# EasyEDA Pro project Sivasankar's_Hackpad_.epro

# Schematic Schematic1_1
Board Name: Board1_1; Create Date: 2026-02-22; Page Name: P1; Project Name: Sivasankar's Hackpad00001; Schematic Name: Schematic1_1; Update Date: 2026-02-22; Company: EasyEDA.com; Page Size: A4; Version: V1.0
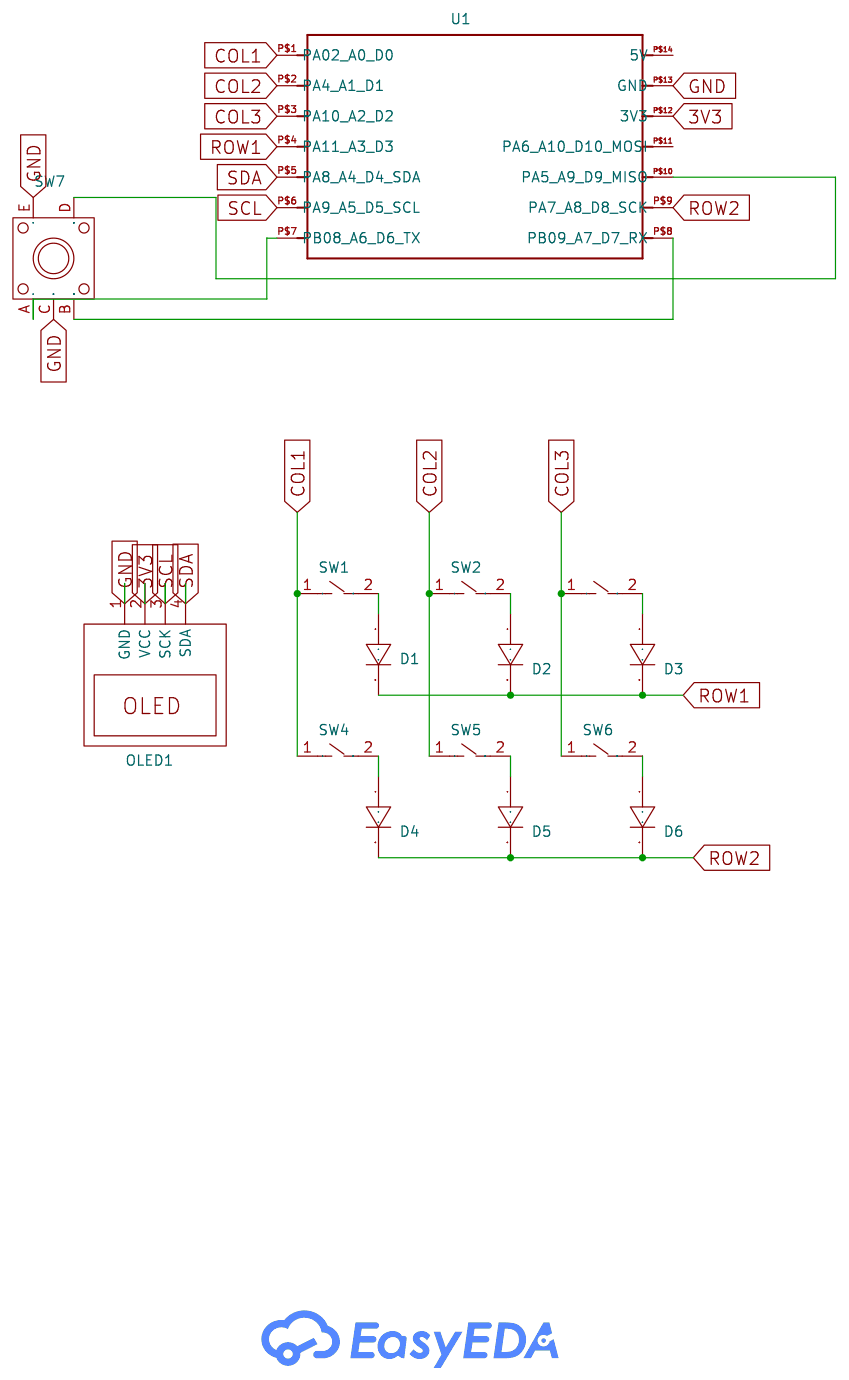
[diagram p0: schematic sheet]

## Parts
D1  1N4148  [DO-35_BD2.0-L4.0-P8.00-D0.5-FD]
D2  1N4148  [DO-35_BD2.0-L4.0-P8.00-D0.5-FD]
D3  1N4148  [DO-35_BD2.0-L4.0-P8.00-D0.5-FD]
D4  1N4148  [DO-35_BD2.0-L4.0-P8.00-D0.5-FD]
D5  1N4148  [DO-35_BD2.0-L4.0-P8.00-D0.5-FD]
D6  1N4148  [DO-35_BD2.0-L4.0-P8.00-D0.5-FD]
OLED1  OLED 0.91  [I2C OLED 0.91]
SW1  MX1A-E1NW  [SW-TH_MX1A-E1NW]
SW2  MX1A-E1NW  [SW-TH_MX1A-E1NW]
SW3  MX1A-E1NW  [SW-TH_MX1A-E1NW]
SW4  MX1A-E1NW  [SW-TH_MX1A-E1NW]
SW5  MX1A-E1NW  [SW-TH_MX1A-E1NW]
SW6  MX1A-E1NW  [SW-TH_MX1A-E1NW]
SW7  EC11  [SW-TH_EC111XXXX]
U1  XIAO_RP2040_XIAO_RP2040_THROUGH_HOLE  [XIAO_THROUGH_HOLE]

## Library data of the parts
D1-D6 = 1N4148_C258182: Diode Configuration: Forward Voltage (Vf@If):1V@10mA Reverse Voltage (Vr): Average Rectified Current (Io): Power Dissipation: Reverse Leakage Current:5uA@75V Reverse Recovery Time (trr): Operating Temperature:-55℃~+175℃@(Tj) Operating Temperature:-55℃~+17; Supplier: LCSC; Supplier Part: C258182; Manufacturer: onsemi(安森美); JLCPCB Part Class: Extended Part; LCSC Part Name: 电压:100V 电流:200mA; Supplier Footprint: DO-35; Datasheet: https://atta.szlcsc.com/upload/public/pdf/source/20180829/C258182_3EE2D0AB6109C1B72B054FC50B8BC8AD.pdf; Forward Voltage (Vf@If): 1V@10mA; Reverse Leakage Current: 5uA@75V; Operating Temperature: -55℃~+175℃@(Tj)
OLED1 = OLED 0.91: Manufacturer Part: SSD1306 I2C OLED
SW1-SW6 = MX1A-E1NW: Supplier Part: C5120587; Manufacturer: CHERRY; Supplier Footprint: 插件; JLCPCB Part Class: Extended Part; Datasheet: https://item.szlcsc.com/datasheet/MX1A-E1NW/5705589.html; Supplier: LCSC
SW7 = EC11: Supplier: LCSC; Supplier Part: C470788; Manufacturer: ALPS Electric; Manufacturer Part: EC1110120005
U1 = XIAO_RP2040_XIAO_RP2040_THROUGH_HOLE

## Nets
3V3: OLED1.2(VCC) U1.P$12(3V3)
GND: OLED1.1(GND) SW7.C SW7.E U1.P$13(GND)
COL1: SW1.1 SW4.1 U1.P$1(PA02_A0_D0)
COL2: SW2.1 SW5.1 U1.P$2(PA4_A1_D1)
COL3: SW3.1 SW6.1 U1.P$3(PA10_A2_D2)
ROW1: D1.2(K) D2.2(K) D3.2(K) U1.P$4(PA11_A3_D3)
ROW2: D4.2(K) D5.2(K) D6.2(K) U1.P$9(PA7_A8_D8_SCK)
SCL: OLED1.3(SCK) U1.P$6(PA9_A5_D5_SCL)
SDA: OLED1.4(SDA) U1.P$5(PA8_A4_D4_SDA)
$1N1168: D6.1(A) SW6.2
$1N4009: D1.1(A) SW1.2
$1N4013: D2.1(A) SW2.2
$1N4023: D3.1(A) SW3.2
$1N4070: D4.1(A) SW4.2
$1N4074: D5.1(A) SW5.2
$1N4276: SW7.A U1.P$7(PB08_A6_D6_TX)
$1N4283: SW7.B U1.P$8(PB09_A7_D7_RX)
$1N4379: SW7.D U1.P$10(PA5_A9_D9_MISO)

Not connected (* = marked no-connect by the designer): U1 P$11(PA6_A10_D10_MOSI) P$14(5V)

# Board PCB3_1
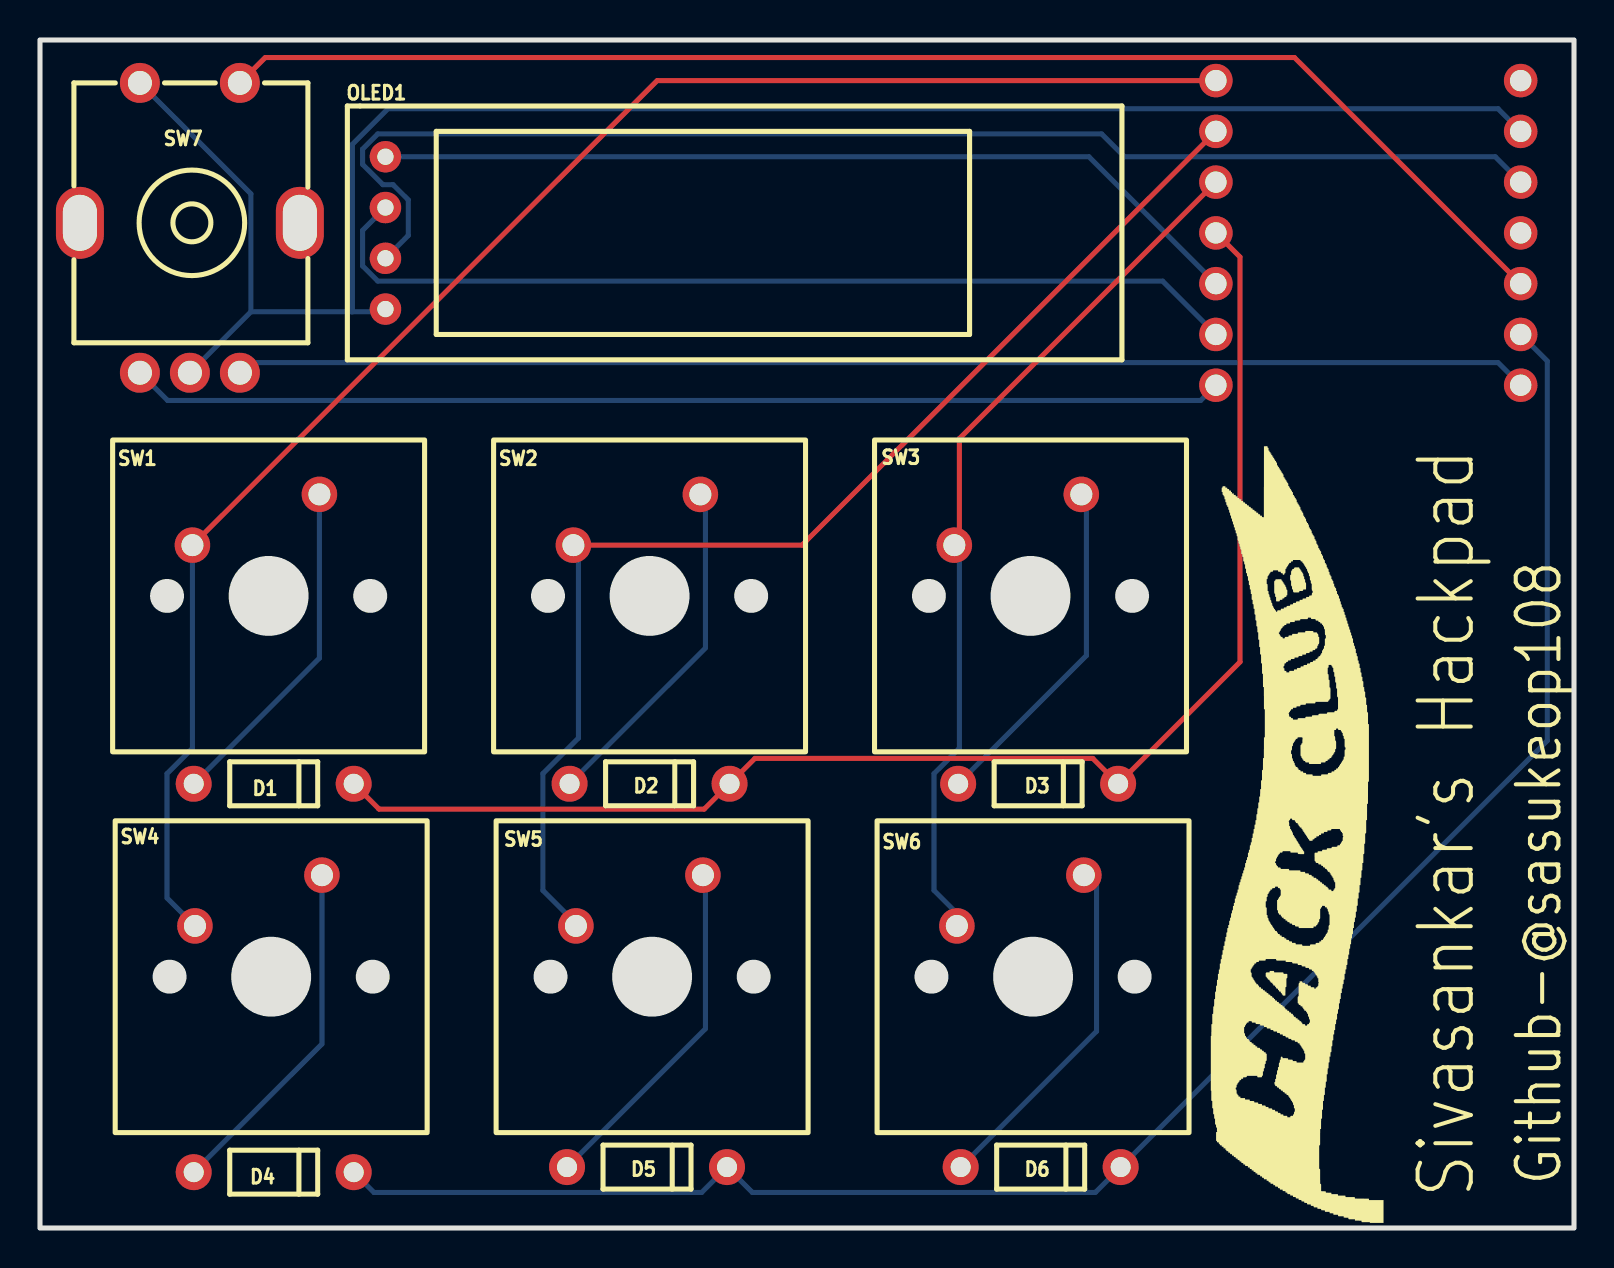
[diagram p1: board, top side]
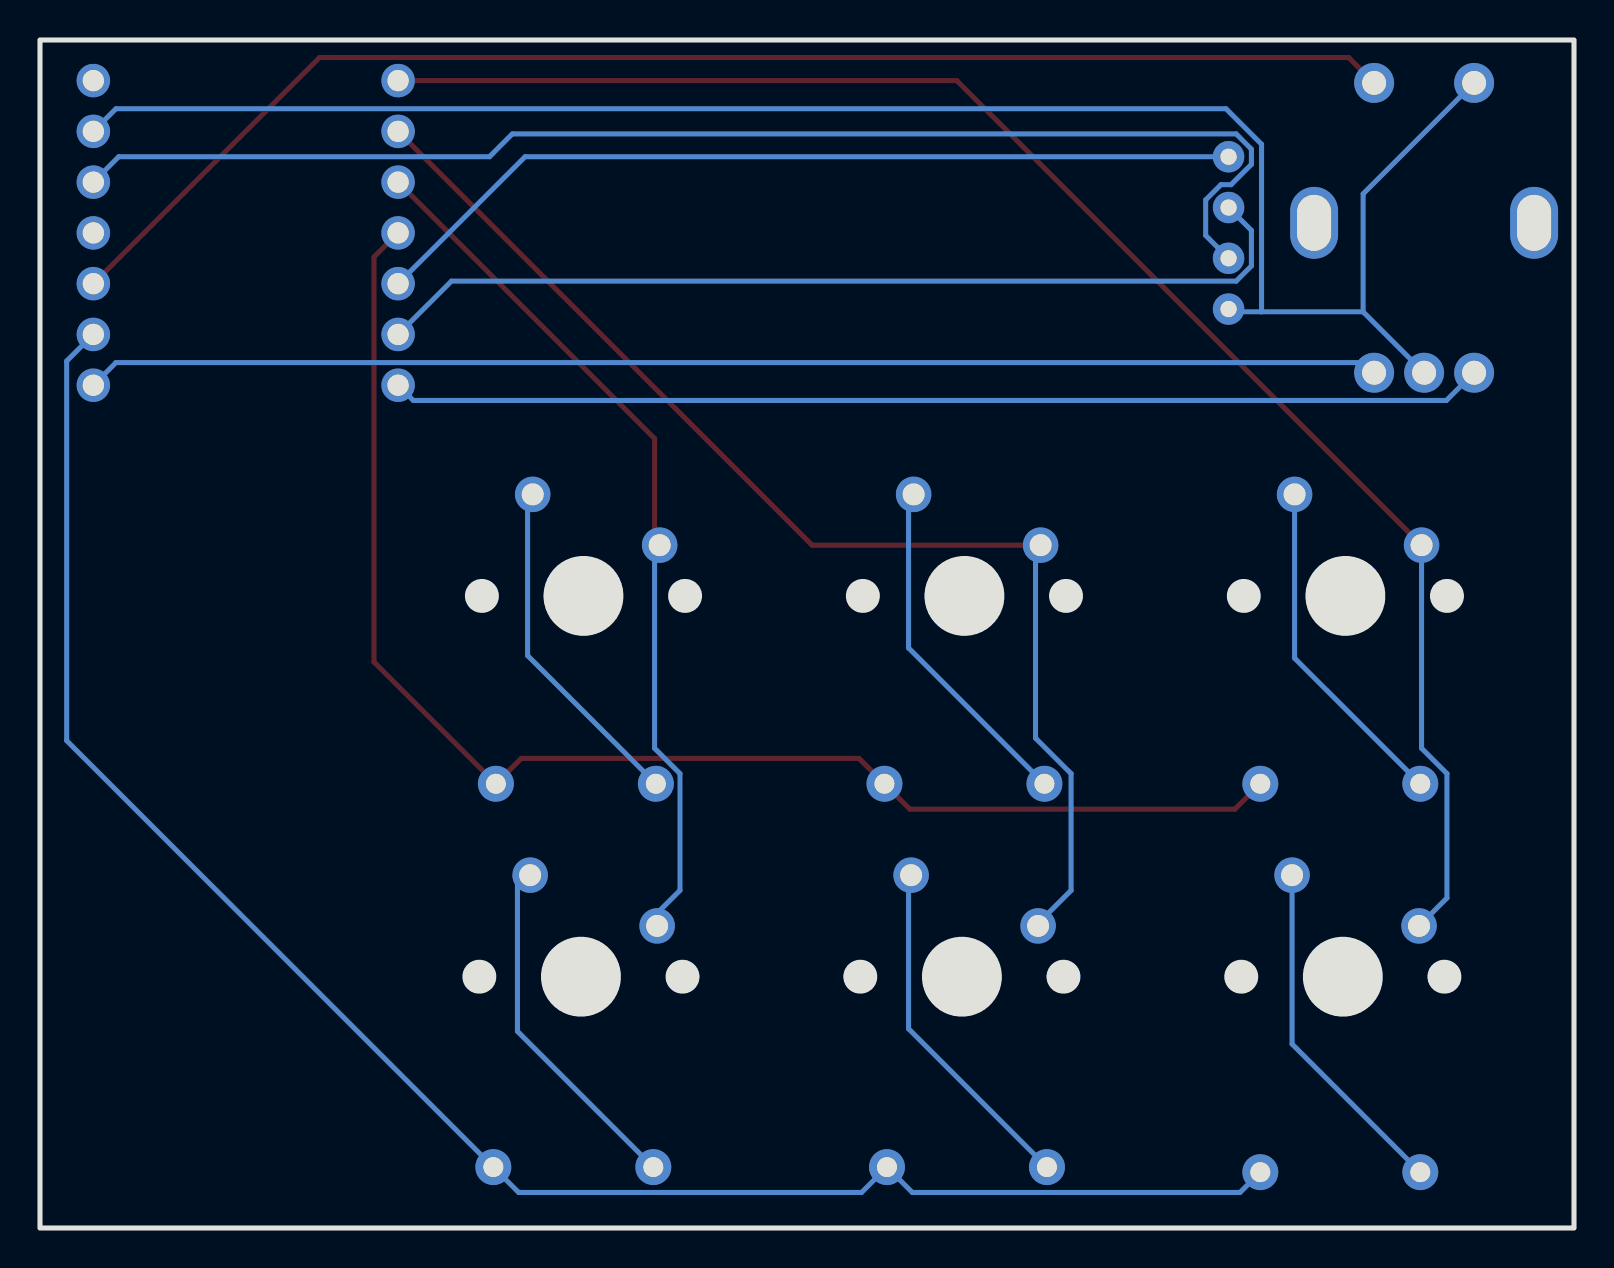
[diagram p2: board, bottom side, seen from below]

Outline 76.71 x 59.44 mm; copper layers: Top Layer, Bottom Layer. Coordinates in mm from the lower left corner of the outline.
Outline path: rectangle 0,59.44 76.71,0
Stack: Top Layer 0.035mm / Dielectric1 1.51mm FR4 er 4.5 / Bottom Layer 0.035mm

## Design rules (mm)
template: JLCPCB Capability(Two Layers Board)
spacing copperThickness1oz (default): track to track 0.102, other pairs 0.152 to 0.3
spacing copperThickness2oz: track to track 0.203, other pairs 0.152 to 0.3
track width copperThickness1oz (default): min 0.127, default 0.254, max 2.54
track width copperThickness2oz: min 0.203, default 0.254, max 2.54
differential pair differentialPair (default): width min 0.127, default 0.254, max 2.54; gap min 0.152, default 0.152
via viaSize (default): diameter min 0.5, default 0.61, max 10; hole min 0.3, default 0.305, max 6.3

## Placement (name value [footprint] x y rotation side)
D1  1N4148  [DO-35_BD2.0-L4.0-P8.00-D0.5-FD]  11.69 22.22 0 top
D2  1N4148  [DO-35_BD2.0-L4.0-P8.00-D0.5-FD]  30.48 22.22 0 top
D3  1N4148  [DO-35_BD2.0-L4.0-P8.00-D0.5-FD]  49.91 22.22 0 top
D4  1N4148  [DO-35_BD2.0-L4.0-P8.00-D0.5-FD]  11.69 2.79 0 top
D5  1N4148  [DO-35_BD2.0-L4.0-P8.00-D0.5-FD]  30.36 3.05 0 top
D6  1N4148  [DO-35_BD2.0-L4.0-P8.00-D0.5-FD]  50.04 3.05 0 top
OLED1  OLED 0.91  [I2C OLED 0.91]  17.27 49.78 0 top
SW1  MX1A-E1NW  [SW-TH_MX1A-E1NW]  10.8 35.43 0 top
SW2  MX1A-E1NW  [SW-TH_MX1A-E1NW]  29.85 35.43 0 top
SW3  MX1A-E1NW  [SW-TH_MX1A-E1NW]  48.9 35.43 0 top
SW4  MX1A-E1NW  [SW-TH_MX1A-E1NW]  10.92 16.38 0 top
SW5  MX1A-E1NW  [SW-TH_MX1A-E1NW]  29.98 16.38 0 top
SW6  MX1A-E1NW  [SW-TH_MX1A-E1NW]  49.02 16.38 0 top
SW7  EC11  [SW-TH_EC111XXXX]  7.5 50.04 0 top
U1  XIAO_RP2040_XIAO_RP2040_THROUGH_HOLE  [XIAO_THROUGH_HOLE]  58.8 57.4 90 top

## Footprints (pads in the part's own frame, mm; a bottom-side part is the same pattern mirrored in y, then rotated)
DO-35_BD2.0-L4.0-P8.00-D0.5-FD
  round 1.8 hole 1: 1(-4,0) 2(4,0)
I2C OLED 0.91
  round 1.575 hole 0.813: 1(0,-3.81) 2(0,-1.27) 3(0,1.27) 4(0,3.81)
SW-TH_EC111XXXX
  oval 2.4x3.6 hole 1.7x2.8: 1(5.5,0.25) 2(-5.5,0.25)
  round 2 hole 1.2: A(-2.5,-7.25) B(2.5,-7.25) C(0,-7.25) D(2.5,7.25) E(-2.5,7.25)
SW-TH_MX1A-E1NW
  round 1.778 hole 1.1: 1(-3.175,-1.27) 2(3.175,1.27)
XIAO_THROUGH_HOLE
  round 1.677 hole 1.067: P$1(0,0) P$2(-2.54,0) P$3(-5.08,0) P$4(-7.62,0) P$5(-10.16,0) P$6(-12.7,0) P$7(-15.24,0) P$8(-15.24,-15.24) P$9(-12.7,-15.24) P$10(-10.16,-15.24) P$11(-7.62,-15.24) P$12(-5.08,-15.24) P$13(-2.54,-15.24) P$14(0,-15.24)

## Nets
As in the schematic.

Pads without a net: SW7 1 2; U1 P$11 P$14

## Routing (per net, layer and track width the routed paths; a pad name or vN(x,y) marks a point on that pad's centre or on a via; arc(x,y) is an arc through that point)
3V3: length 66.4
  Bottom Layer w0.254: U1.P$12 72.77,53.59 54.23,53.59 53.09,54.74 16.89,54.74 16.13,53.97 16.13,53.21 17.15,52.2 17.66,52.2 18.42,51.44 18.42,49.66 OLED1.2
GND: length 92.9
  Bottom Layer w0.254: U1.P$13 72.91,56 17.4,56 15.62,54.22 15.62,45.84 ; 15.62,45.84 17.14,45.84 OLED1.1 ; 15.62,45.84 10.54,45.84 ; SW7.E 10.54,51.74 10.54,45.84 ; 10.54,45.84 SW7.C
COL1: length 81
  Top Layer w0.254: SW1.1 30.86,57.4 U1.P$1
  Bottom Layer w0.254: SW1.1 7.62,24 6.35,22.73 6.35,16.51 SW4.1
COL2: length 61
  Top Layer w0.254: 26.93,34.16 38.1,34.16 U1.P$2
  Bottom Layer w0.254: 26.93,34.16 26.93,24.51 25.15,22.73 25.15,16.89 26.93,15.11
COL3: length 43.8
  Top Layer w0.254: 45.98,34.16 45.98,39.5 U1.P$3
  Bottom Layer w0.254: 46.48,15.11 44.71,16.89 44.71,22.73 45.98,24 45.98,34.16
ROW1: length 70.9
  Top Layer w0.254: U1.P$4 60.01,48.58 60.01,28.32 D3.2 52.64,23.5 35.75,23.5 D2.2 33.21,20.95 16.96,20.95 D1.2
ROW2: length 91.4
  Bottom Layer w0.254: D4.2 16.7,1.78 33.09,1.78 D5.2 35.63,1.78 52.77,1.78 D6.2 75.38,24.38 75.38,43.37 U1.P$9
SCL: length 47.5
  Bottom Layer w0.254: OLED1.3 16.13,49.91 16.13,48.13 16.89,47.37 56.14,47.37 U1.P$6
SDA: length 44.2
  Bottom Layer w0.254: U1.P$5 52.45,53.59 OLED1.4
$1N1168: length 17.4
  Bottom Layer w0.254: D6.1 52.83,9.84 52.83,17.65
$1N4009: length 17.1
  Bottom Layer w0.254: SW1.2 13.97,28.51 D1.1
$1N4013: length 17.3
  Bottom Layer w0.254: 33.28,36.7 33.28,29.02 D2.1
$1N4023: length 17.1
  Bottom Layer w0.254: D3.1 52.33,28.64 52.33,36.7
$1N4070: length 17.5
  Bottom Layer w0.254: SW4.2 14.1,9.21 D4.1
$1N4074: length 17.5
  Bottom Layer w0.254: D5.1 33.28,9.97 33.28,17.65
$1N4276: length 54.7
  Bottom Layer w0.254: SW7.A 6.38,41.4 58.04,41.4 U1.P$7
$1N4283: length 64.7
  Bottom Layer w0.254: SW7.B 10.5,43.3 72.91,43.3 U1.P$8
$1N4379: length 69.3
  Top Layer w0.254: SW7.D 11.27,58.56 62.73,58.56 U1.P$10

## Text on the board
Top Silkscreen Layer: Github-@sasukeop108 | Sivasankar's Hackpad
